# EasyEDA Pro project ProPrj_TCC_PCB.epro

# Schematic Schematic1
Board Name: Board1; Create Date: 2025-01-26; Page Name: P1; Project Name: TCC_PCB; Schematic Name: Schematic1; Update Date: 2025-01-26; Company: EasyEDA.com; Page Size: A4; Version: V1.0
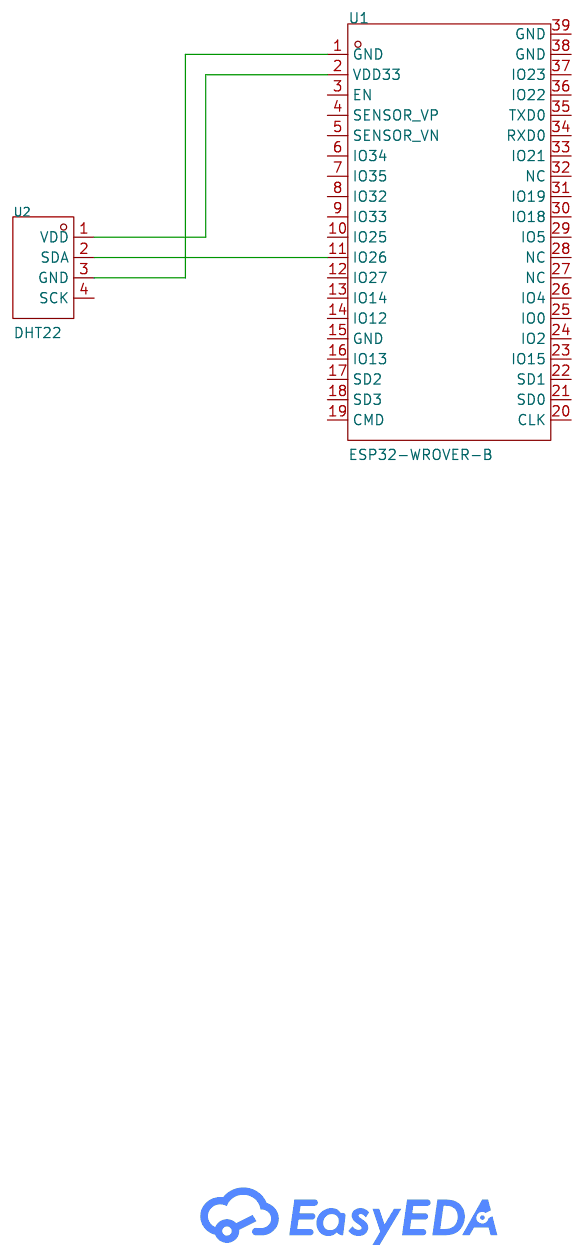
[diagram p0: schematic sheet]

## Parts
U1  ESP32-WROVER-B  [WIFIM-SMD_39P-L31.4-W18.0-P1.27]
U2  DHT22  [SENSOR-TH_HAIGU_DHT22]

## Library data of the parts
U1 = ESP32-WROVER-B: LCSC Part Name: 通用型Wi-Fi+BT+BLE MCU模组; Supplier Part: C503591; Manufacturer: ESPRESSIF(乐鑫); Supplier Footprint: SMD,18x31.4mm; JLCPCB Part Class: Extended Part; Datasheet: https://atta.szlcsc.com/upload/public/pdf/source/20200407/C503591_C87358A0C7E7634BF69262C64DCED650.pdf; Supplier: LCSC
U2 = DHT22: Temperature:-40℃~+80℃ Temperature:-40℃~+80℃ Humidity:5%RH~99%RH Humidity:5%RH~99%RH Supply Voltage:3.3V Supply Voltage:3.3V Supply Current:500uA Resolution:±3%RH Resolution:±3%RH; LCSC Part Name: 数字温湿度模块12mm*15.5mm*5.9mm; Supplier Part: C2880291; Manufacturer: HAIGU(广州海谷); Supplier Footprint: 插件; Datasheet: https://atta.szlcsc.com/upload/public/pdf/source/20230523/7507864DBB8AF99FF82B5DD1568971DB.pdf; Supplier: LCSC; Temperature: -40℃~+80℃; Humidity: 5%RH~99%RH; Supply Voltage: 3.3V; Supply Current: 500uA; Resolution: ±3%RH

## Nets
Net-(U1-1): U1.1(GND) U2.3(GND)
Net-(U1-2): U1.2(VDD33) U2.1(VDD)
Net-(U1-11): U1.11(IO26) U2.2(SDA)

Not connected (* = marked no-connect by the designer): U1 3(EN) 4(SENSOR_VP) 5(SENSOR_VN) 6(IO34) 7(IO35) 8(IO32) 9(IO33) 10(IO25) 12(IO27) 13(IO14) 14(IO12) 15(GND) 16(IO13) 17(SD2) 18(SD3) 19(CMD) 20(CLK) 21(SD0) 22(SD1) 23(IO15) 24(IO2) 25(IO0) 26(IO4) 27(NC) 28(NC) 29(IO5) 30(IO18) 31(IO19) 32(NC) 33(IO21) 34(RXD0) 35(TXD0) 36(IO22) 37(IO23) 38(GND) 39(GND); U2 4(SCK)
